# EAGLE design olimex_add_on (EAGLE 6.1)
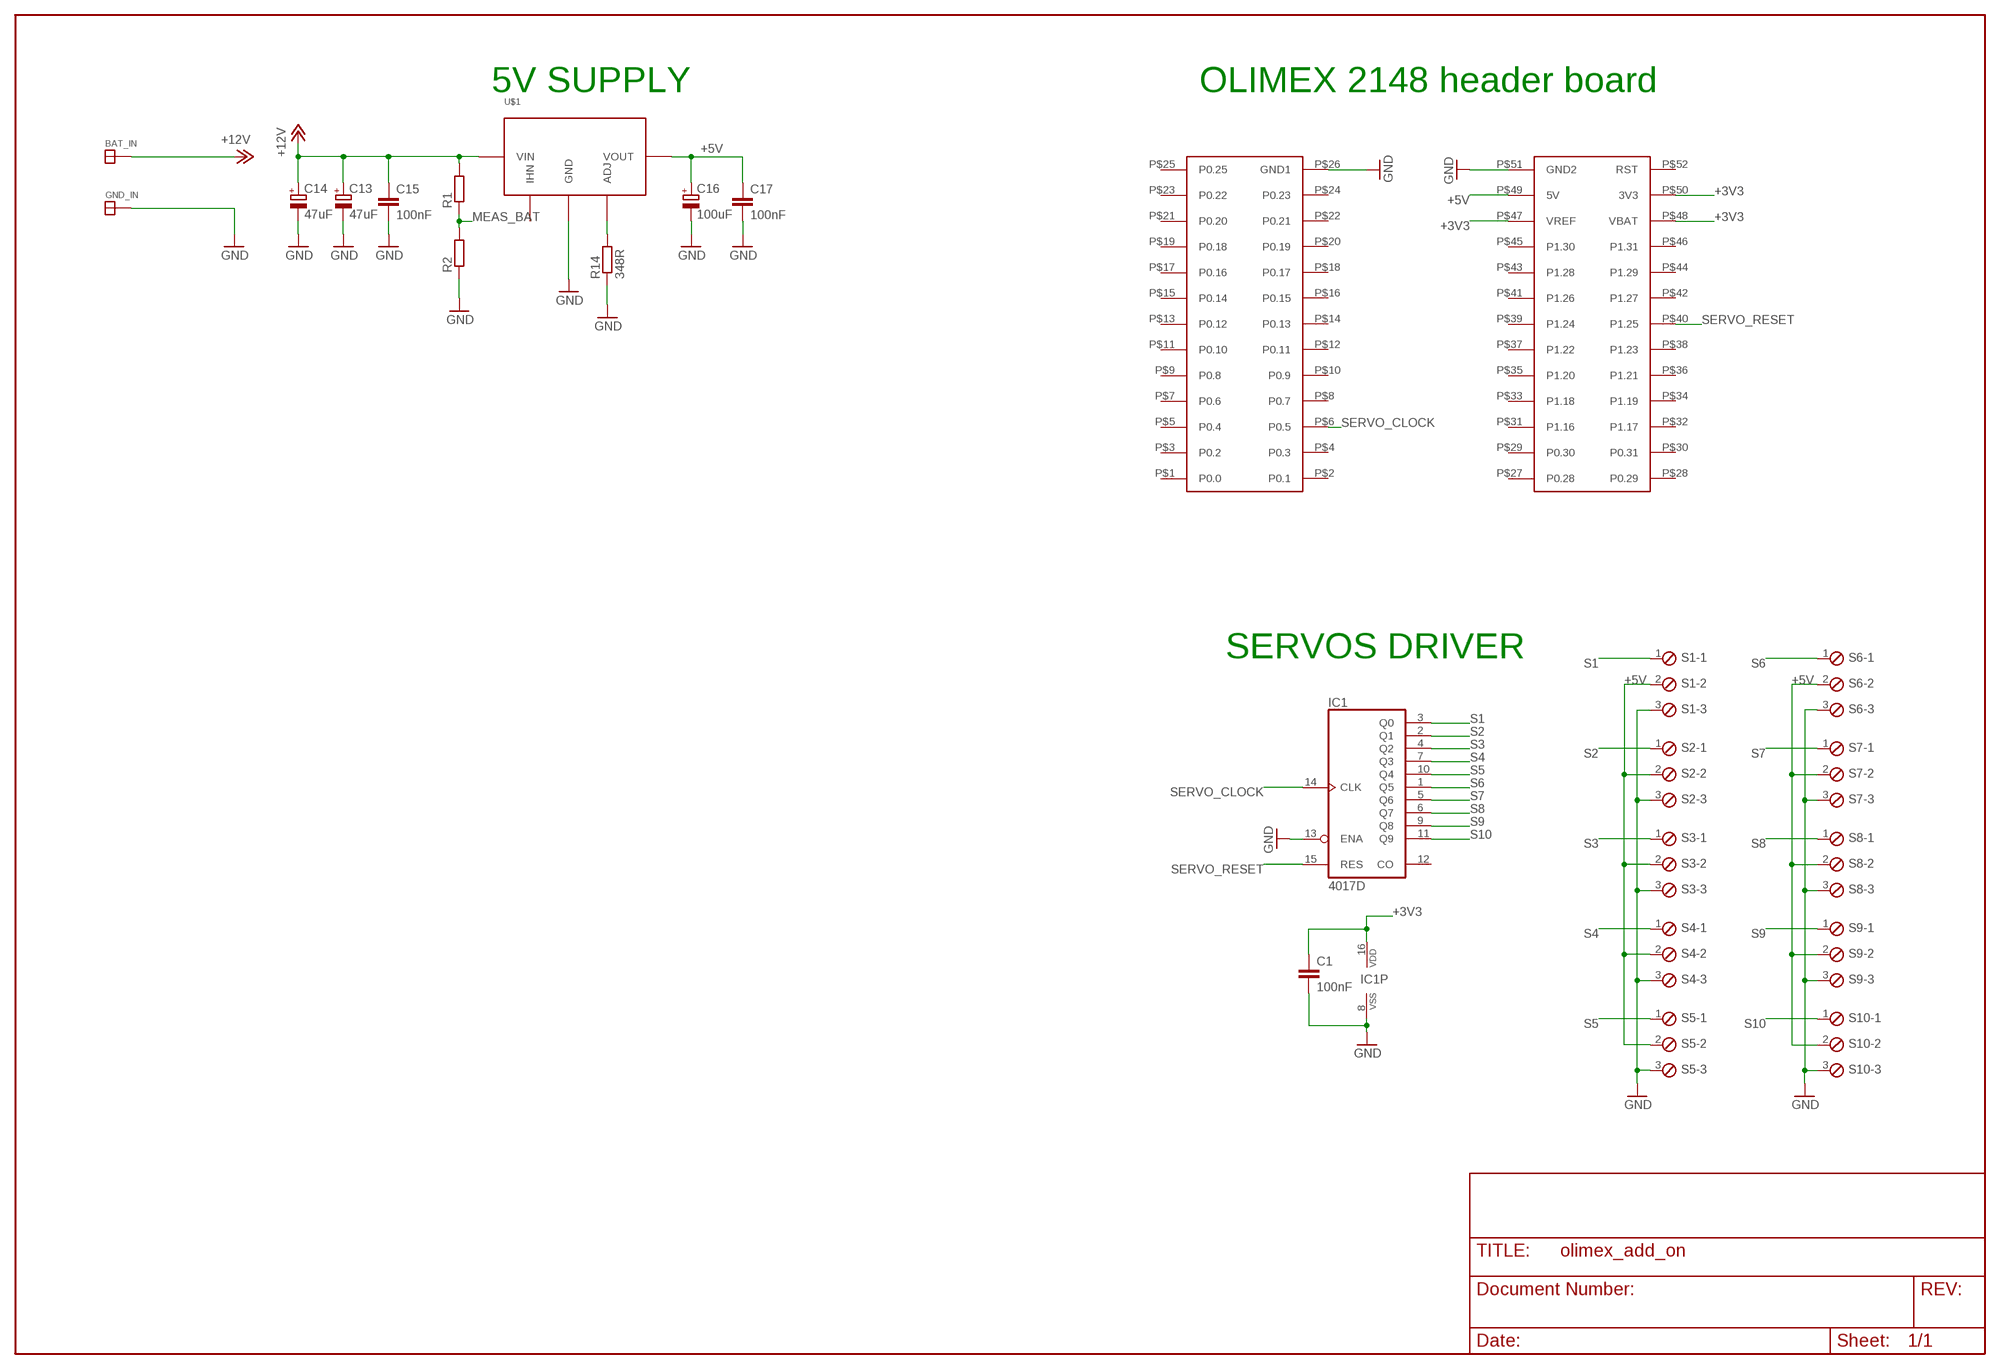
[diagram p0: schematic, sheet 1]

## Parts
BAT_IN  SOLDER_PAD150_75  [SOLD_PAD_150_75]
C1  100nF  C-EUC0805K  [C0805K]
C13  47uF  CPOL-EUSMCD  [SMC_D]
C14  47uF  CPOL-EUSMCD  [SMC_D]
C15  100nF  C-EUC1206K  [C1206K]
C16  100uF  CPOL-EUSMCD  [SMC_D]
C17  100nF  C-EUC1206K  [C1206K]
GND_IN  SOLDER_PAD150_75  [SOLD_PAD_150_75]
IC1  4017D  [SO16]
R1  R-EU_R0805  [R0805]
R2  R-EU_R0805  [R0805]
R14  348R  R-EU_R0805  [R0805]
S1  MPT3  [3POL254]
S2  MPT3  [3POL254]
S3  MPT3  [3POL254]
S4  MPT3  [3POL254]
S5  MPT3  [3POL254]
S6  MPT3  [3POL254]
S7  MPT3  [3POL254]
S8  MPT3  [3POL254]
S9  MPT3  [3POL254]
S10  MPT3  [3POL254]
U$1  PTH  [PTH]
U$5  OLIMEX_2148  [OLIMEX_2148]

## Nets
+3V3: C1.1 IC1.16(VDD) U$5.P$47(VREF) U$5.P$48(VBAT) U$5.P$50(3V3)
+5V: C16.+ C17.1 S1.2 S2.2 S3.2 S4.2 S5.2 S6.2 S7.2 S8.2 S9.2 S10.2 U$1.P$3(VOUT) U$5.P$49(5V)
+12V: BAT_IN.P$1 C13.+ C14.+ C15.1 R1.2 U$1.P$1(VIN)
GND: C1.2 C13.- C14.- C15.2 C16.- C17.2 GND_IN.P$1 IC1.8(VSS) IC1.13(ENA) R2.1 R14.1 S1.3 S2.3 S3.3 S4.3 S5.3 S6.3 S7.3 S8.3 S9.3 S10.3 U$1.P$2(GND) U$5.P$26(GND1) U$5.P$51(GND2)
MEAS_BAT: R1.1 R2.2
N$5: R14.2 U$1.P$4(ADJ)
S1: IC1.3(Q0) S1.1
S2: IC1.2(Q1) S2.1
S3: IC1.4(Q2) S3.1
S4: IC1.7(Q3) S4.1
S5: IC1.10(Q4) S5.1
S6: IC1.1(Q5) S6.1
S7: IC1.5(Q6) S7.1
S8: IC1.6(Q7) S8.1
S9: IC1.9(Q8) S9.1
S10: IC1.11(Q9) S10.1
SERVO_CLOCK: IC1.14(CLK) U$5.P$6(P0.5)
SERVO_RESET: IC1.15(RES) U$5.P$40(P1.25)
Unconnected: IC1.12(CO) U$1.P$5(IHN) U$5.P$1(P0.0) U$5.P$2(P0.1) U$5.P$3(P0.2) U$5.P$4(P0.3) U$5.P$5(P0.4) U$5.P$7(P0.6) U$5.P$8(P0.7) U$5.P$9(P0.8) U$5.P$10(P0.9) U$5.P$11(P0.10) U$5.P$12(P0.11) U$5.P$13(P0.12) U$5.P$14(P0.13) U$5.P$15(P0.14) U$5.P$16(P0.15) U$5.P$17(P0.16) U$5.P$18(P0.17) U$5.P$19(P0.18) U$5.P$20(P0.19) U$5.P$21(P0.20) U$5.P$22(P0.21) U$5.P$23(P0.22) U$5.P$24(P0.23) U$5.P$25(P0.25) U$5.P$27(P0.28) U$5.P$28(P0.29) U$5.P$29(P0.30) U$5.P$30(P0.31) U$5.P$31(P1.16) U$5.P$32(P1.17) U$5.P$33(P1.18) U$5.P$34(P1.19) U$5.P$35(P1.20) U$5.P$36(P1.21) U$5.P$37(P1.22) U$5.P$38(P1.23) U$5.P$39(P1.24) U$5.P$41(P1.26) U$5.P$42(P1.27) U$5.P$43(P1.28) U$5.P$44(P1.29) U$5.P$45(P1.30) U$5.P$46(P1.31) U$5.P$52(RST)

## Notes on the sheet
- 5V SUPPLY | OLIMEX 2148 header board
- SERVOS DRIVER

## Library data of the parts
BAT_IN GND_IN = paparazzi:SOLDER_PAD
C1 C15 C17 = rcl:C-EU: CAPACITOR, European symbol
C13 C14 C16 = rcl:CPOL-EU: POLARIZED CAPACITOR, European symbol
IC1 = 40xx:4017: COUNTER/DIVIDER
R1 R2 R14 = rcl:R-EU_: RESISTOR, European symbol
S1-S10 = paparazzi:MPT3: PHOENIX CONNECTOR
U$1 = paparazzi:PTH
U$5 = paparazzi:OLIMEX_2148

## Board
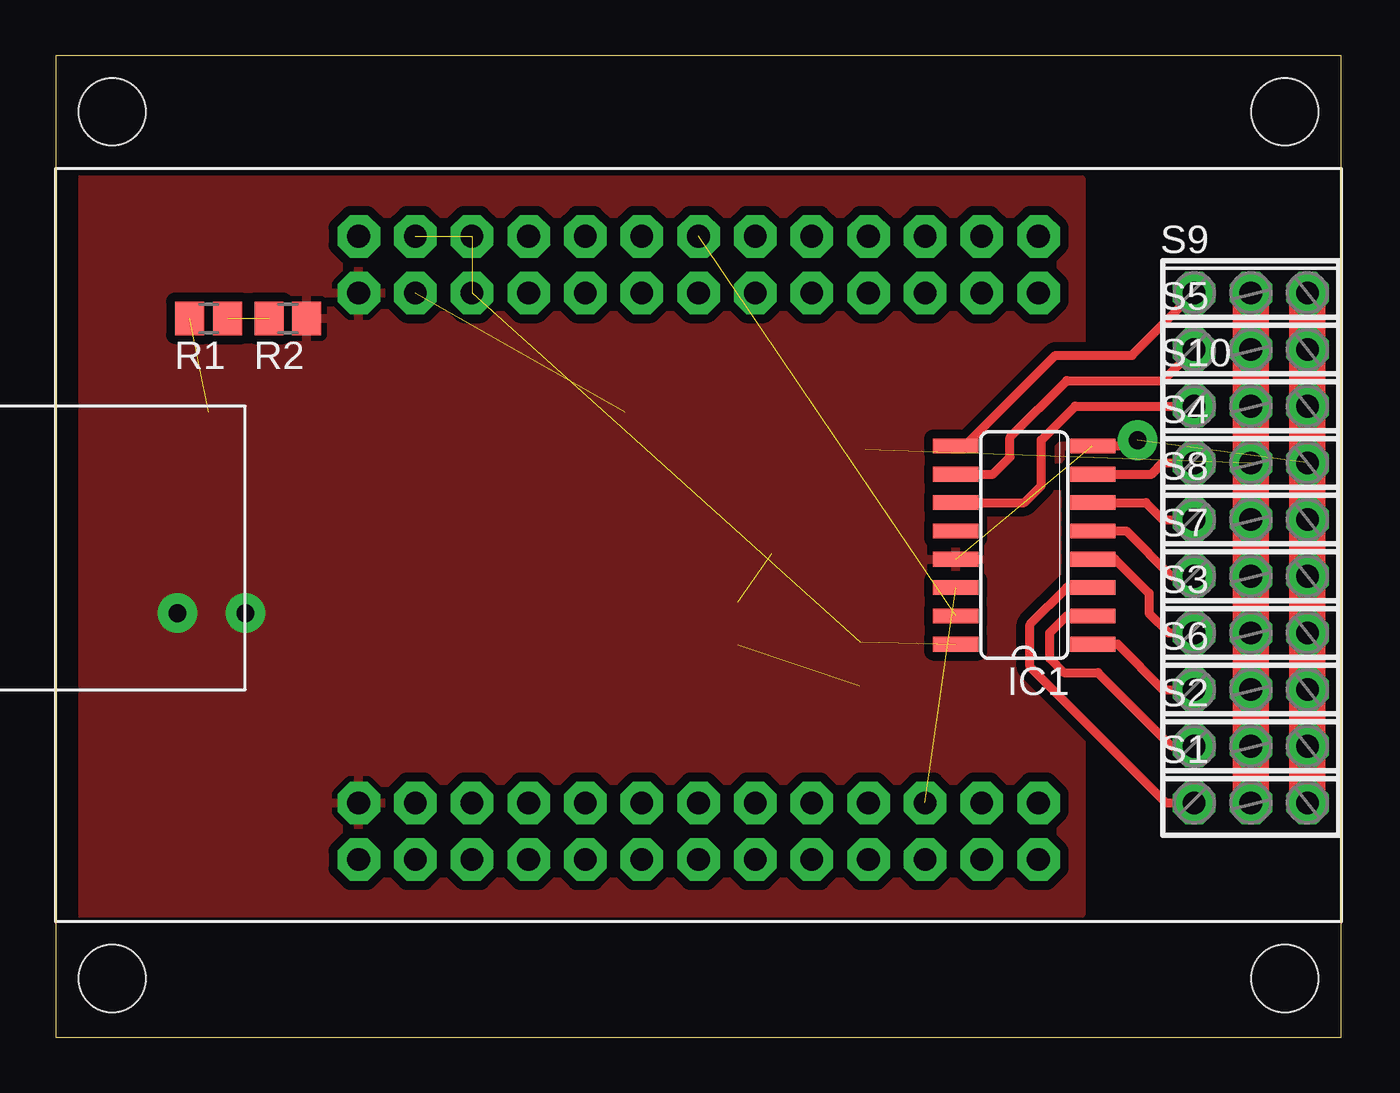
[diagram p1: board, top side]
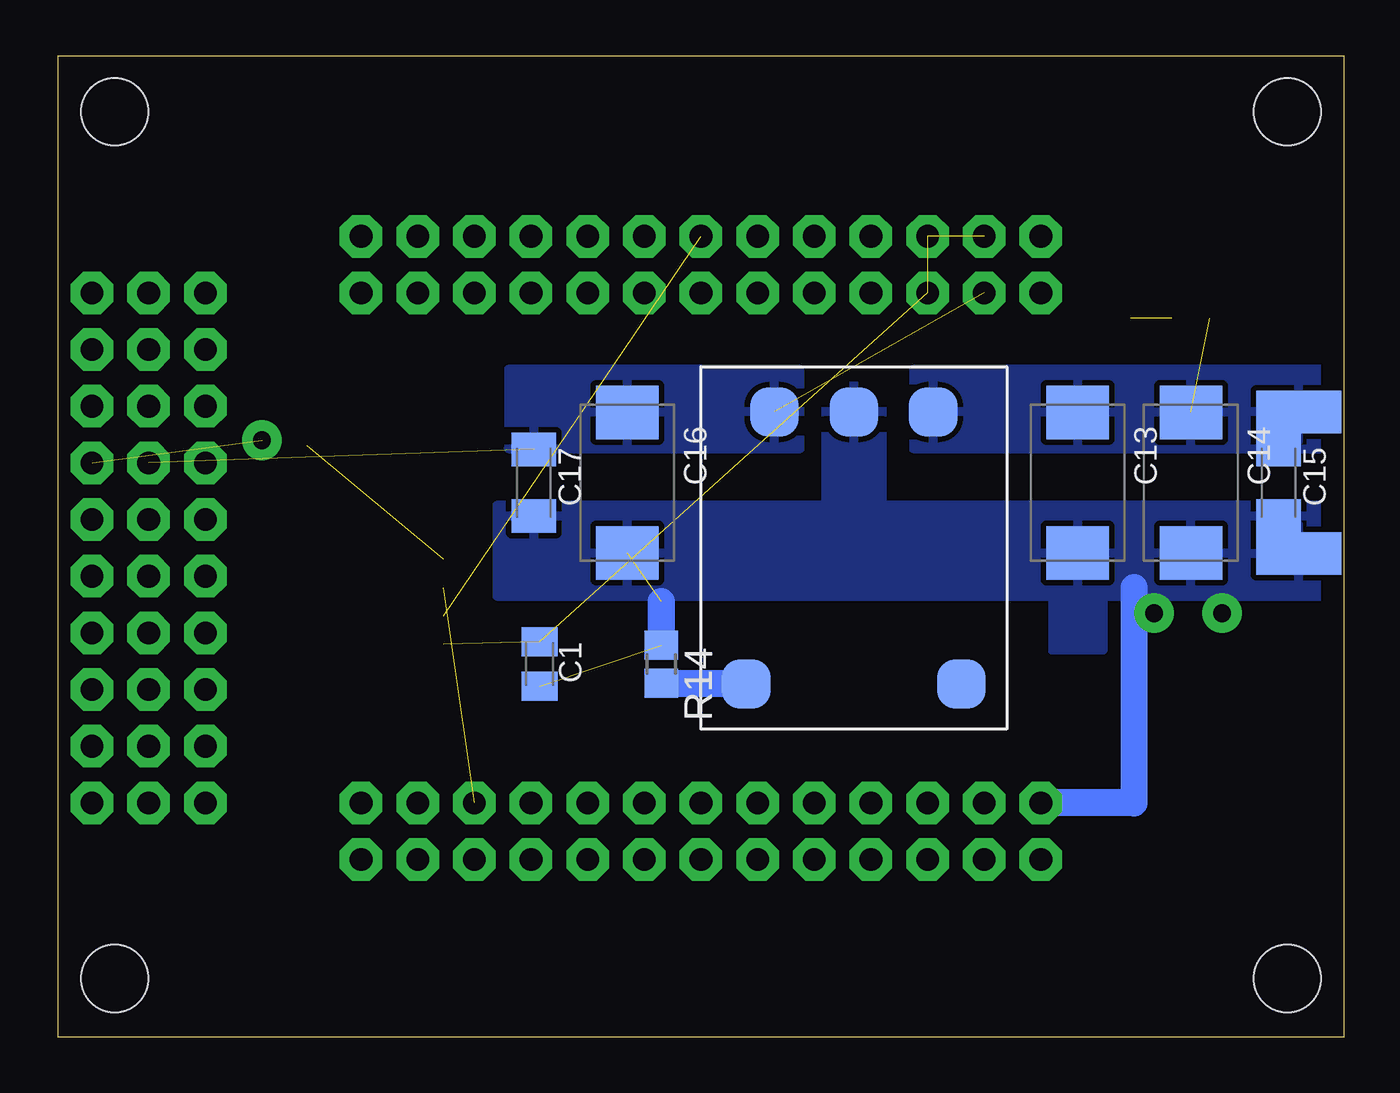
[diagram p2: board, bottom side, seen from below]

Size 57.64 x 43.99 mm. Coordinates in mm from the lower left corner, seen from the top.
Outline: 0,0 57.64,0 57.64,43.99 0,43.99 0,0
Copper layers (1*16): Top 0.035mm / dielectric 1.5mm / Bottom 0.035mm
Design rules: minimum track width 10mil, minimum drill 24mil, track to track 8mil, track to pad 8mil, pad to pad 8mil, via to via 8mil, smd to smd 8mil, copper to edge 40mil, drill to drill 8mil, minimum pad ring 10mil, minimum via ring 8mil, stop-mask expansion 4mil, vias tented up to drill 0mil, thermal gap 10mil
Holes 3 mm at 2.54,41.49 2.54,2.63 55.11,41.49 55.11,2.63

### Footprints (pad centres in the part's own frame; a part is rotated, then mirrored left to right if it is on the bottom)
SOLD_PAD_150_75 = smd 3.81 x 1.905: P$1 0,0
C0805K = smd 1.3 x 1.6: 1 -1,0; 2 1,0
SMC_D = smd 2.4 x 2.8: + -3.15,0; - 3.15,0
C1206K = smd 1.5 x 2: 1 -1.5,0; 2 1.5,0
SO16 = smd 0.66 x 2.032: 1 -4.445,-3.073; 2 -3.175,-3.073; 3 -1.905,-3.073; 4 -0.635,-3.073; 5 0.635,-3.073; 6 1.905,-3.073; 7 3.175,-3.073; 8 4.445,-3.073; 9 4.445,3.073; 10 3.175,3.073; 11 1.905,3.073; 12 0.635,3.073; 13 -0.635,3.073; 14 -1.905,3.073; 15 -3.175,3.073; 16 -4.445,3.073
R0805 = smd 1.3 x 1.5: 1 -0.85,0; 2 0.85,0
3POL254 = drill 1.016 pad 1.905 octagon: 1 -2.54,0; 2 0,0; 3 2.54,0
PTH = smd 2.184 x 2.184: P$1 -6.096,3.556; P$2 -6.096,0; P$3 -6.096,-3.556; P$4 6.096,-4.826; P$5 6.096,4.826
OLIMEX_2148 = drill 1.016 pad 1.905 octagon: P$1 0,-1.27; P$2 0,1.27; P$3 -2.54,-1.27; P$4 -2.54,1.27; P$5 -5.08,-1.27; P$6 -5.08,1.27; P$7 -7.62,-1.27; P$8 -7.62,1.27; P$9 -10.16,-1.27; P$10 -10.16,1.27; P$11 -12.7,-1.27; P$12 -12.7,1.27; P$13 -15.24,-1.27; P$14 -15.24,1.27; P$15 -17.78,-1.27; P$16 -17.78,1.27; P$17 -20.32,-1.27; P$18 -20.32,1.27; P$19 -22.86,-1.27; P$20 -22.86,1.27; P$21 -25.4,-1.27; P$22 -25.4,1.27; P$23 -27.94,-1.27; P$24 -27.94,1.27; P$25 -30.48,-1.27; P$26 -30.48,1.27; P$27 0,24.13; P$28 0,26.67; P$29 -2.54,24.13; P$30 -2.54,26.67; P$31 -5.08,24.13; P$32 -5.08,26.67; P$33 -7.62,24.13; P$34 -7.62,26.67; P$35 -10.16,24.13; P$36 -10.16,26.67; P$37 -12.7,24.13; P$38 -12.7,26.67; P$39 -15.24,24.13; P$40 -15.24,26.67; P$41 -17.78,24.13; P$42 -17.78,26.67; P$43 -20.32,24.13; P$44 -20.32,26.67; P$45 -22.86,24.13; P$46 -22.86,26.67; P$47 -25.4,24.13; P$48 -25.4,26.67; P$49 -27.94,24.13; P$50 -27.94,26.67; P$51 -30.48,24.13; P$52 -30.48,26.67

### Placement (x,y rotation side)
BAT_IN  2.03,28.03 180 bottom
C1  36.06,16.73 270 bottom
C13  11.93,24.85 270 bottom
C14  6.85,24.85 270 bottom
C15  2.92,24.85 270 bottom
C16  32.13,24.85 270 bottom
C17  36.32,24.85 270 bottom
GND_IN  2.03,21.68 180 bottom
IC1  43.43,22.06 90 top
R1  6.85,32.22 180 top
R2  10.41,32.22 180 top
R14  30.6,16.73 270 bottom
S1  53.59,10.5 0 top
S2  53.59,13.04 0 top
S3  53.59,18.12 0 top
S4  53.59,25.74 0 top
S5  53.59,30.82 0 top
S6  53.59,15.58 0 top
S7  53.59,20.66 0 top
S8  53.59,23.2 0 top
S9  53.59,33.36 0 top
S10  53.59,28.28 0 top
U$1  21.97,21.93 270 bottom
U$5  44.06,9.23 0 top

### Tracks (layer width: path | path; a pad name or v marks a point on that pad's centre or on a via)
+3V3  (4 unrouted)
+5V  (2 unrouted)
  Top 1.626: S9.2 S5.2 S10.2 S4.2 S8.2 S7.2 S3.2 S6.2 S2.2 S1.2
  pour Bottom (isolate 0.406): 24.38,26.38 24.38,29.93 37.46,29.93 37.46,26.38
+12V  (1 unrouted)
  Bottom 0.406: C15.1 2.92,28.03
  pour Bottom (isolate 0.406): 0.12,29.93 19.3,29.93 19.3,26.38 0.12,26.38
GND  (via drill 0.8 pad 1.78)  (4 unrouted)
  Top 0.406: 46.48,26.5 IC1.8 48.26,26.5 v48.51,26.76
  Top 1.626: S9.3 S5.3 S10.3 S4.3 S8.3 S7.3 S3.3 S6.3 S2.3 S1.3
  Bottom 1.219: U$5.P$26 9.39,10.5 9.39,20.16 | R14.1 30.6,19.52
  other vias: 5.46,19.01 8.5,19.01
  pour Bottom (isolate 0.406): 0.12,19.77 0.12,23.84 20.7,23.84 20.7,29.17 23.24,29.17 23.24,23.84 37.97,23.84 37.97,19.77 13.08,19.77 13.08,17.36 10.79,17.36 10.79,19.77
  pour Top (isolate 0.406): 0.63,38.44 45.97,38.44 45.97,5.55 0.63,5.55
MEAS_BAT  (1 unrouted)
N$5
  Bottom 1.219: R14.2 30.6,15.84 U$1.P$4
S1
  Top 0.406: IC1.3 45.33,20.16 43.68,18.5 43.68,16.6 49.78,10.5 S1.1
S2
  Top 0.406: IC1.2 45.33,18.88 44.57,18.12 44.57,16.98 45.21,16.34 46.73,16.34 50.03,13.04 S2.1
S3
  Top 0.406: IC1.4 47.49,21.42 49.02,19.9 49.02,19.01 49.91,18.12 S3.1
S4
  Top 0.406: IC1.7 49.14,25.23 49.65,25.74 S4.1
S5
  Top 0.406: IC1.10 42.03,25.23 42.79,26 42.79,26.89 45.33,29.43 49.65,29.43 S5.1
S6
  Top 0.406: IC1.1 47.62,17.61 49.65,15.58 S6.1
S7
  Top 0.406: IC1.5 48,22.7 50.03,20.66 S7.1
S8
  Top 0.406: IC1.6 48.89,23.96 49.65,23.2 S8.1
S9
  Top 0.406: IC1.9 40.76,26.5 44.83,30.57 48.26,30.57 S9.1
S10
  Top 0.406: IC1.11 43.43,23.96 44.19,24.73 44.19,26.76 45.72,28.28 S10.1
SERVO_CLOCK  (1 unrouted)
SERVO_RESET  (1 unrouted)